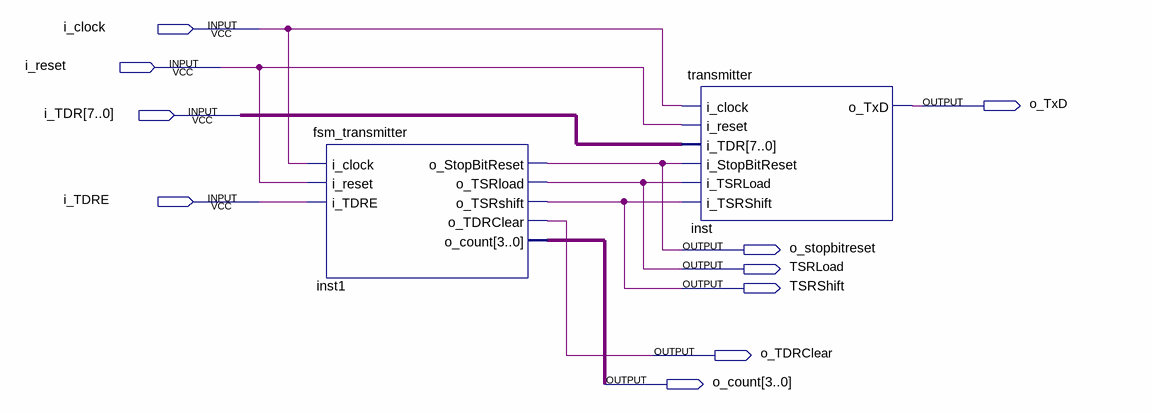
[diagram p0: schematic sheet]
// Quartus schematic top_transmitter.bdf as structural Verilog: 2 symbols, 10 pins
module top_transmitter (
  input  i_clock,
  input  i_reset,
  input  [7:0] i_TDR,
  input  i_TDRE,
  output o_TxD,
  output o_stopbitreset,
  output TSRLoad,
  output TSRShift,
  output o_TDRClear,
  output [3:0] o_count
);

  fsm_transmitter inst1 (
    .i_clock(i_clock), .i_reset(i_reset), .i_TDRE(i_TDRE), .o_StopBitReset(o_stopbitreset),
    .o_TSRload(TSRLoad), .o_TSRshift(TSRShift), .o_TDRClear(o_TDRClear), .o_count(o_count));
  transmitter inst (
    .i_clock(i_clock), .i_reset(i_reset), .i_TDR(i_TDR), .i_StopBitReset(o_stopbitreset),
    .i_TSRLoad(TSRLoad), .i_TSRShift(TSRShift), .o_TxD(o_TxD));
endmodule
